# EasyEDA Pro project ProDoc_TP_V2.8_OP.epro

# Schematic Schematic_28_OP

## Sheets
1 MCU: Board Name: TP_V2.8; Create Date: 2024-10-01; Page Name: MCU; Project Name: gavvv; Schematic Name: Schematic_28; Update Date: 2024-10-01; Company: 嘉立创EDA; Page Size: A4; Version: V1.0
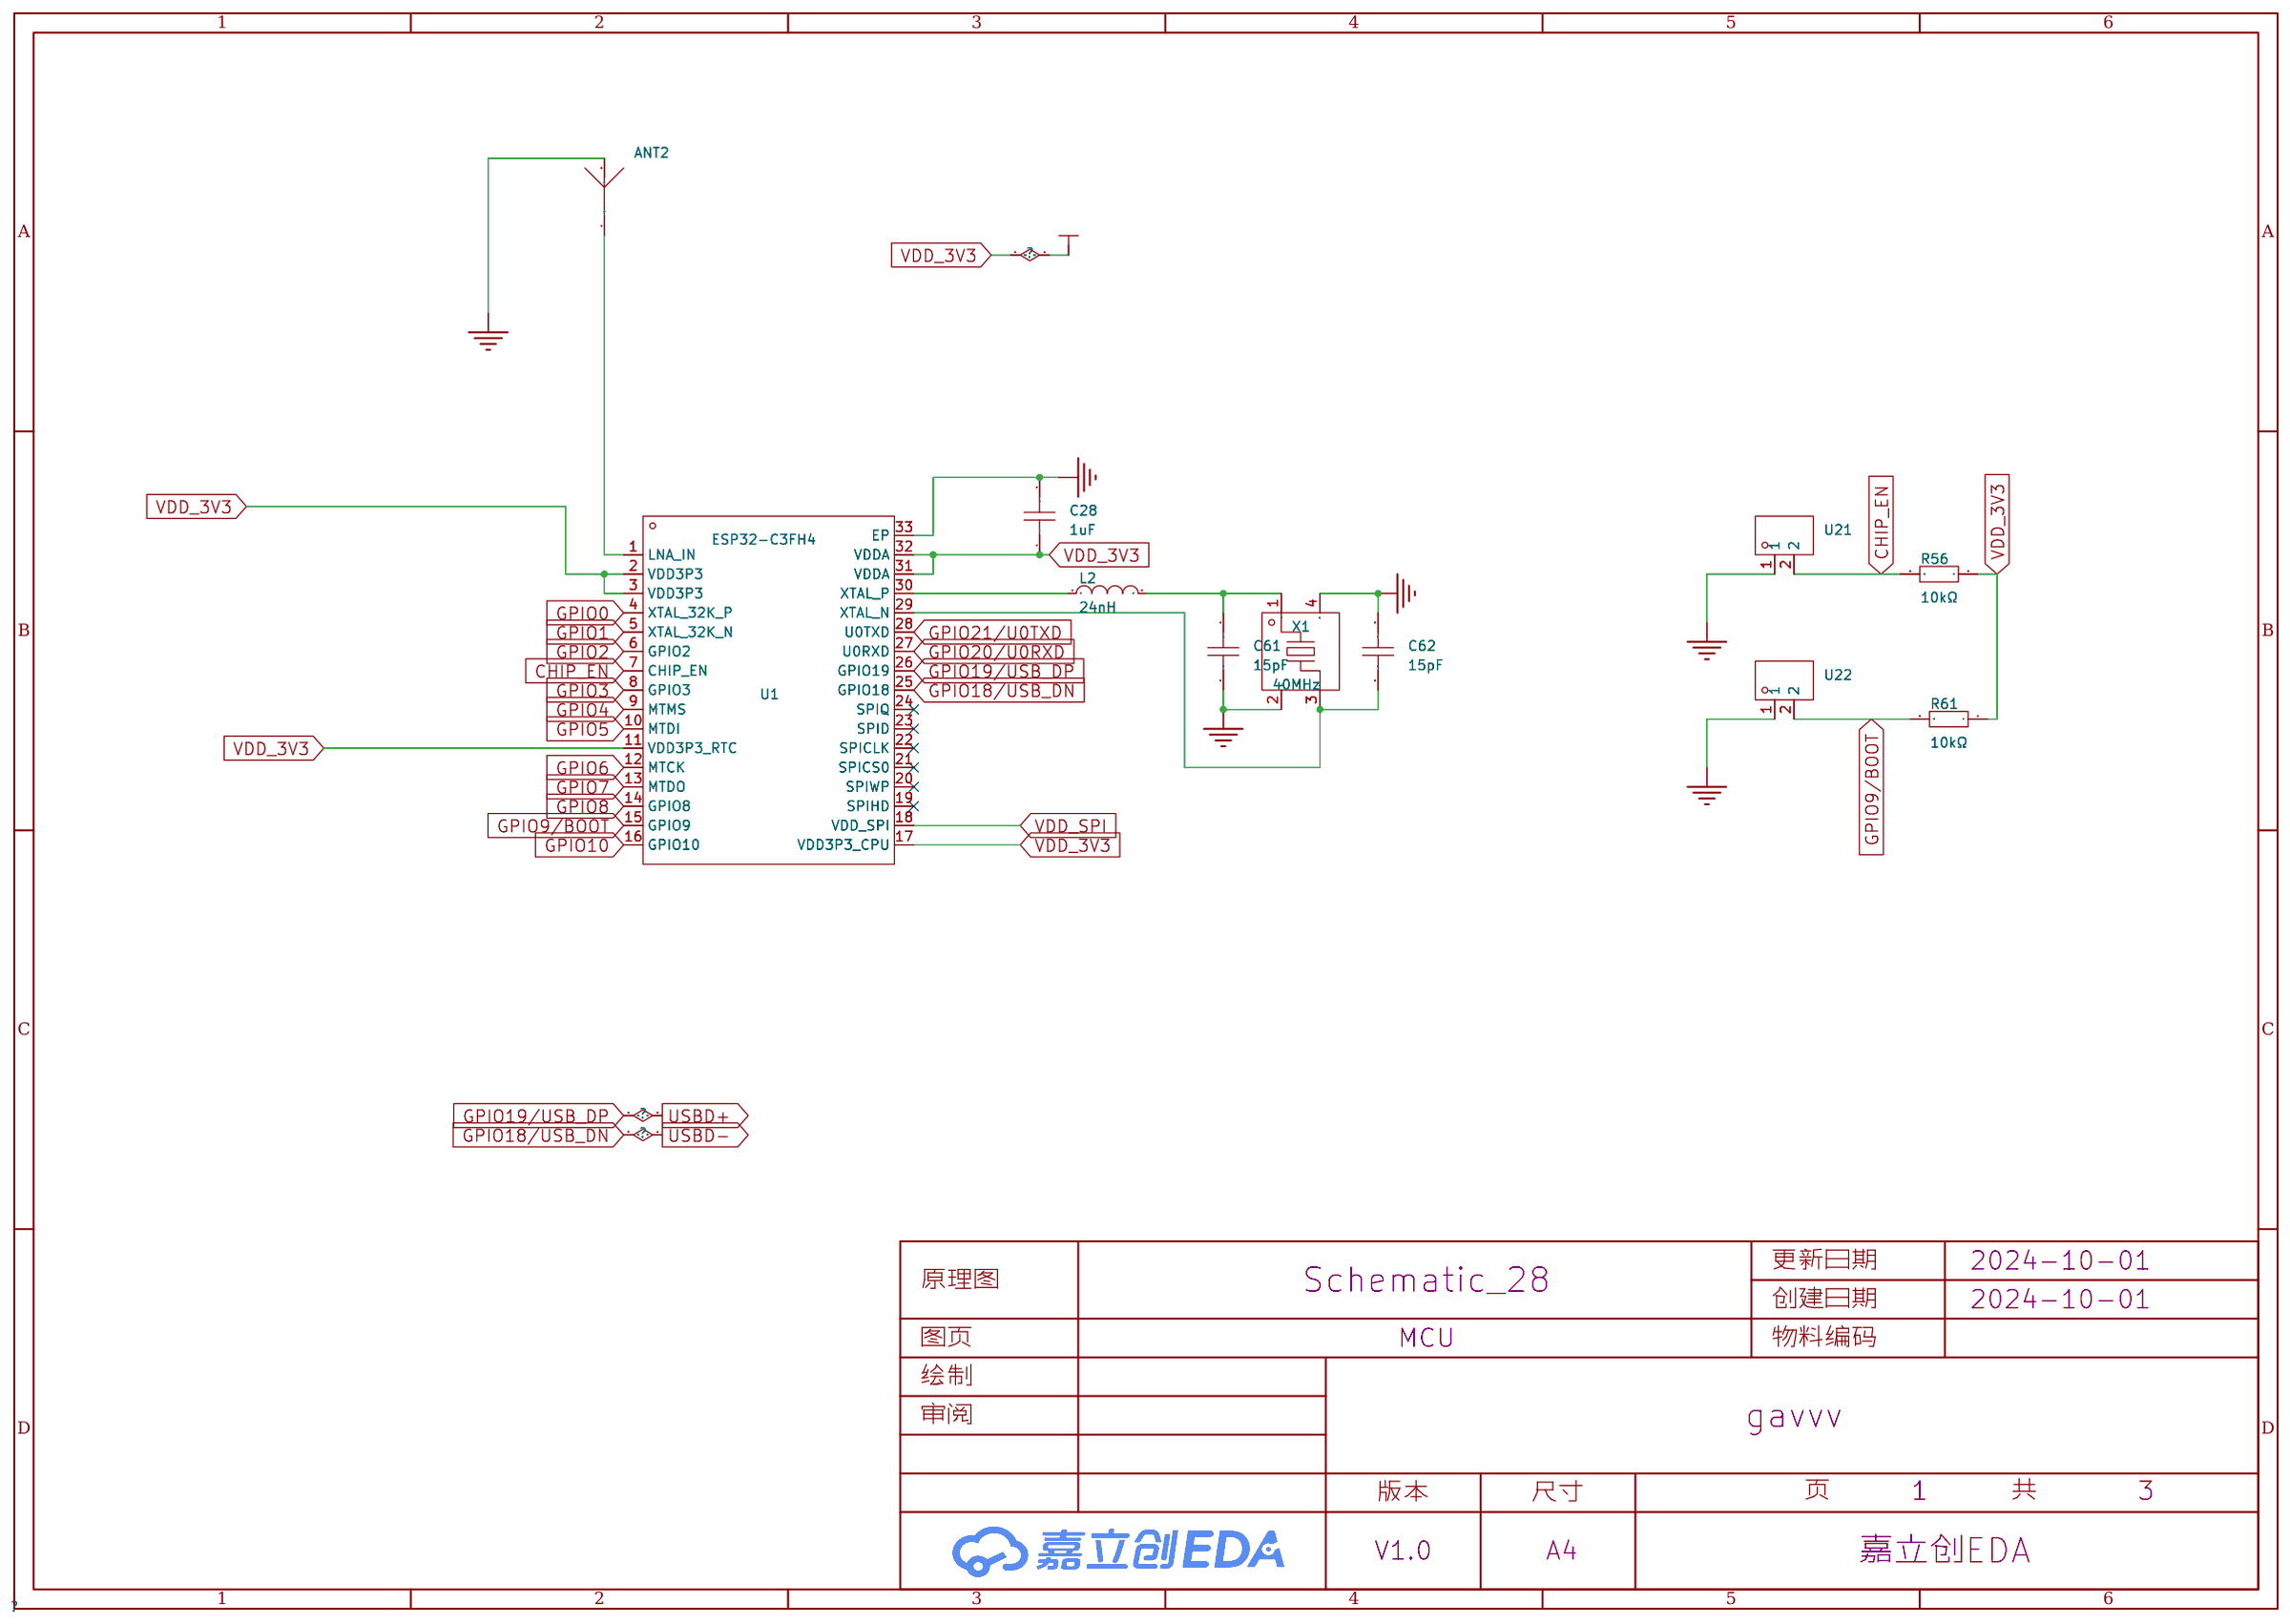
[diagram p0: MCU]
2 PWR: Page Name: PWR
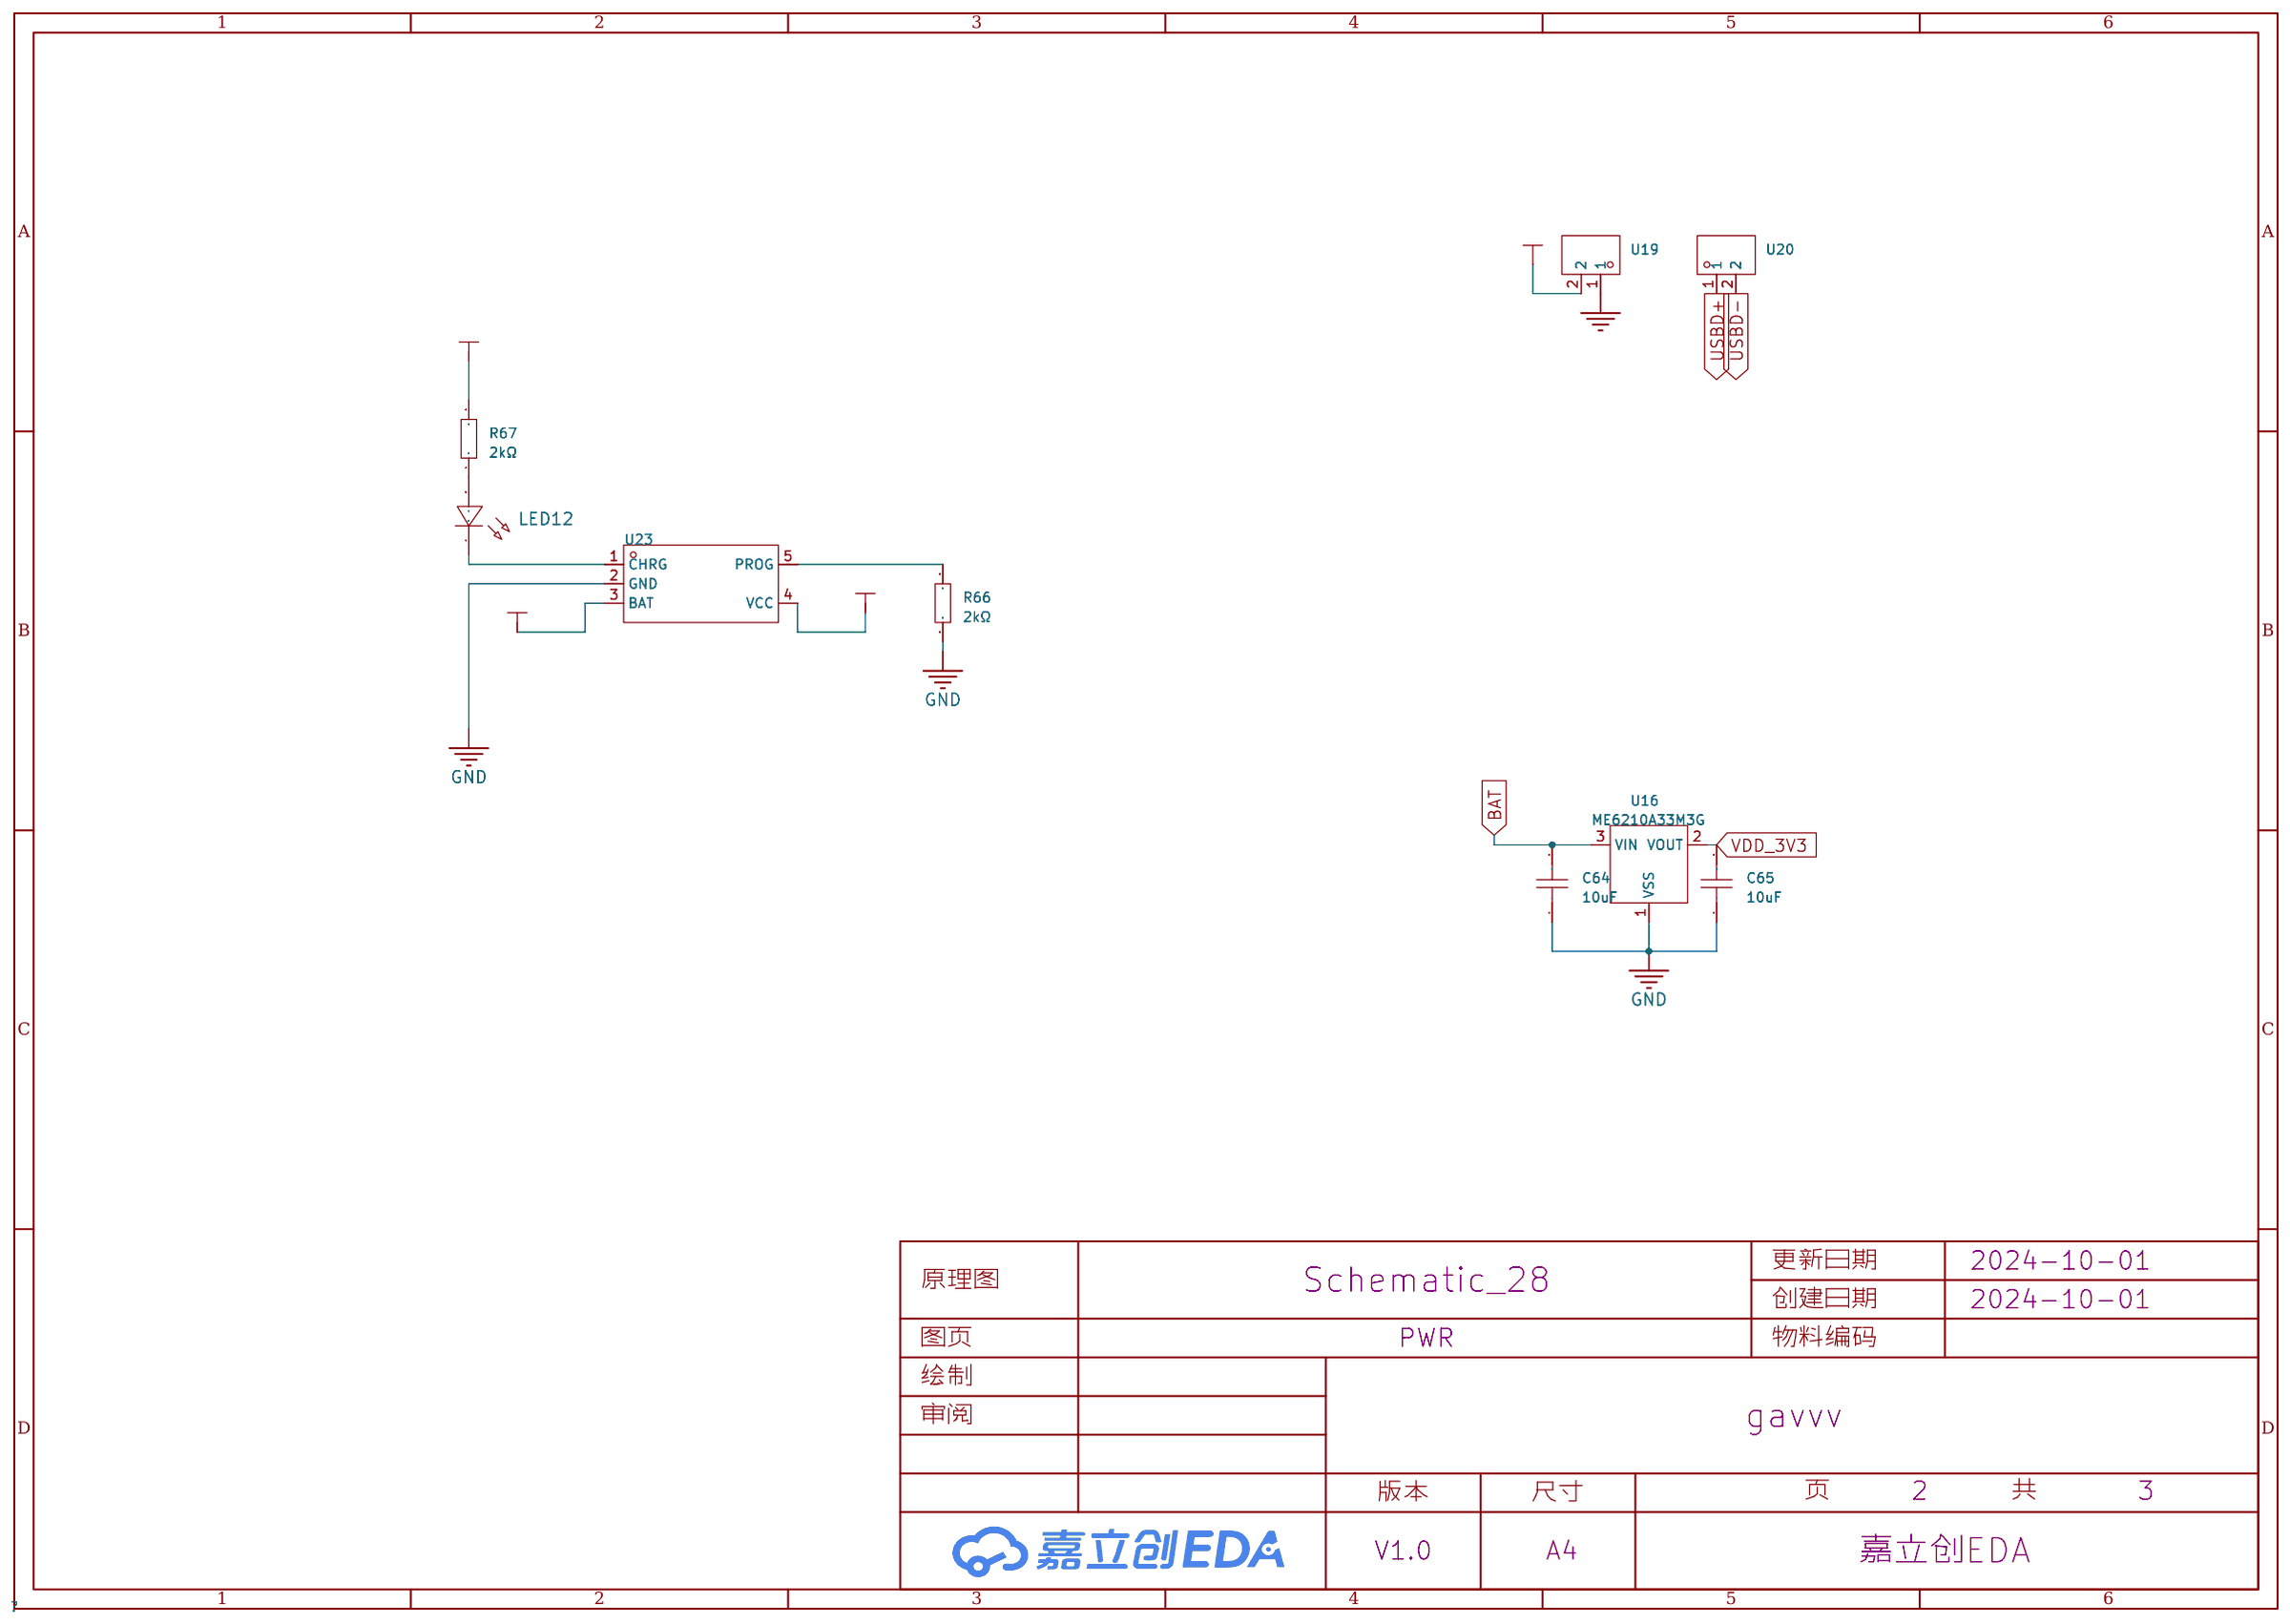
[diagram p1: PWR]
3 USER: Board Name: TP_V2.8_OP; Create Date: 2024-10-05; Page Name: USER; Schematic Name: Schematic_28_OP; Update Date: 2024-10-05
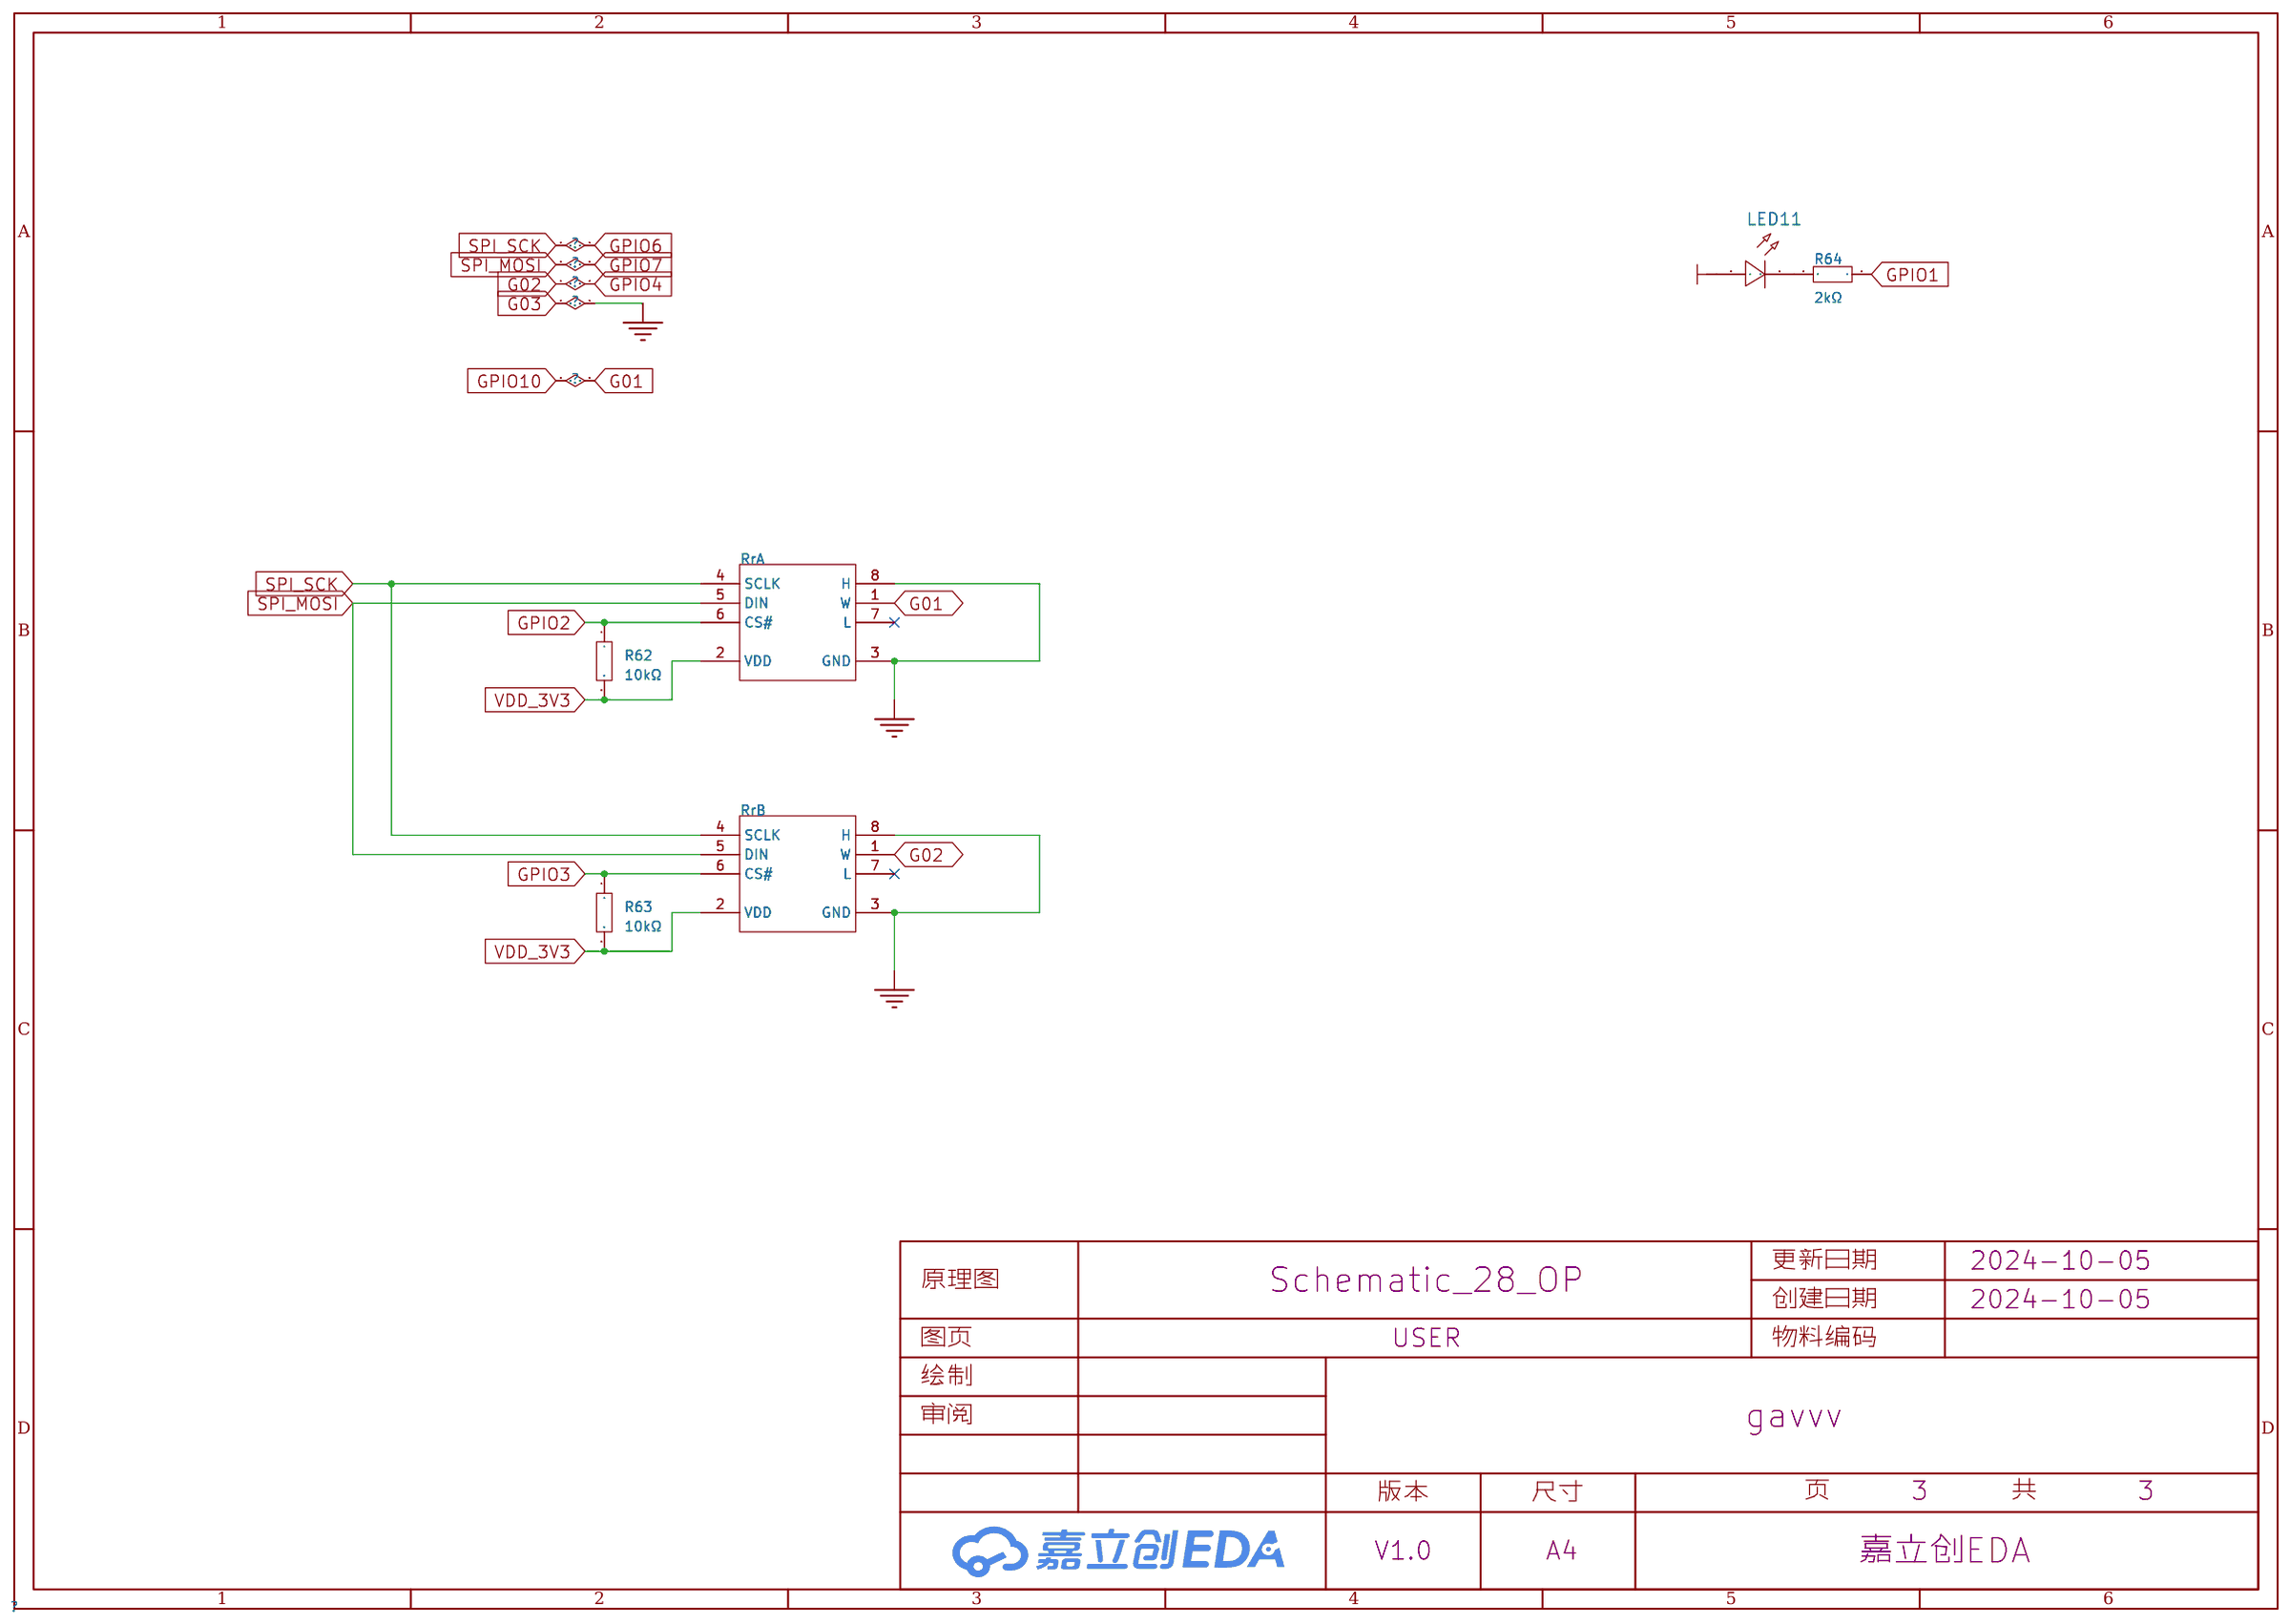
[diagram p2: USER]

## Parts
sheet MCU
ANT2  -  [ANT-SMD_L3.2-W1.6_CA-C01]
C28  1uF  [C0402]
C61  15pF  [C0402]
C62  15pF  [C0402]
L2  24nH  [IND-SMD_L1.0-W0.5-2]
R56  10kΩ  [R0402]
R61  10kΩ  [R0402]
U1  ESP32-C3FH4  [QFN-32_L5.0-W5.0-P0.50-TL-EP3.7]
U21  HX PZ1.0-1x2P ZZ  [HDR-TH_2P-P1.00-V-M]
U22  HX PZ1.0-1x2P ZZ  [HDR-TH_2P-P1.00-V-M]
X1  40MHz  [CRYSTAL-SMD_4P-L2.0-W1.6-BL_ECS_ECS-240-8-37]
sheet PWR
C64  10uF  [C0402]
C65  10uF  [C0402]
LED12  LED0402-红色  [LED0402-RD_RED]
R66  2kΩ  [R0402]
R67  2kΩ  [R0402]
U16  ME6210A33M3G  [SOT-23-3_L3.0-W1.7-P0.95-LS2.9-BR]
U19  X1311WV-02J-C40D24  [HDR-TH_2P-P1.27-V-M]
U20  X1311WV-02J-C40D24  [HDR-TH_2P-P1.27-V-M]
U23  TP4054  [SOT-23-5_L2.9-W1.6-P0.95-LS2.8-BR]
sheet USER
LED11  LED0402-红色  [LED0402-RD_RED]
R62  10kΩ  [R0402]
R63  10kΩ  [R0402]
R64  2kΩ  [R0402]
RrA  TPL0501-100DCNR  [SOT-23-8_L3.0-W1.7-P0.65-LS2.8-BL]
RrB  TPL0501-100DCNR  [SOT-23-8_L3.0-W1.7-P0.65-LS2.8-BL]

## Library data of the parts
ANT2 = CA-C01: Supplier Part: C9900018999; Supplier Footprint: SMD_3.2x1.6x0.4mm; JLCPCB Part Class: ExtendedPart; Datasheet: https://atta.szlcsc.comnull; Supplier: LCSC
C28 C61 C62 C64 C65 = CL05B104KB54PNC: 容值:100nF;精度:±10%;额定电压:50V;材质(温度系数):X7R;; LCSC Part Name: 100nF ±10% 50V; Supplier Part: C307331; Manufacturer: SAMSUNG(三星); Supplier Footprint: 0402; JLCPCB Part Class: 基础库; Datasheet: https://atta.szlcsc.com/upload/public/pdf/source/20181009/C307331_222F7C870FD3EA5F46F538B483443886.pdf; Supplier: LCSC; Tolerance: ±10%; Voltage Rated: 50V; Temperature Coefficient: X7R
L2 = LQW15AN24NG80D: 电感值:24nH;精度:±2%;额定电流:770mA;饱和电流(Isat):-;; LCSC Part Name: 24nH ±2%; Supplier Part: C668462; Manufacturer: muRata(村田); Supplier Footprint: 0402; JLCPCB Part Class: 扩展库; Datasheet: https://atta.szlcsc.com/upload/public/pdf/source/20201228/C668462_EF8FB8FB445A38E861DA03D3842BC057.pdf; Supplier: LCSC; Tolerance: ±2%; Rated Current: 770mA; DC Resistance (DCR): 212mΩ
R56 R61-R63 = 0402WGF1002TCE: 阻值:10kΩ;精度:±1%;功率:62.5mW;温度系数:±100ppm/℃;电阻类型:厚膜电阻;; LCSC Part Name: 10kΩ ±1% 62.5mW 厚膜电阻; Supplier Part: C25744; Manufacturer: UNI-ROYAL(厚声); Supplier Footprint: 0402; JLCPCB Part Class: Basic Part; Datasheet: https://atta.szlcsc.com/upload/public/pdf/source/20200306/C422600_1E6D84923E4A46A82E41ADD87F860B5C.pdf; Supplier: LCSC; Tolerance: ±1%; Power(Watts): 62.5mW; Overload Voltage (Max): 50V; Temperature Coefficient: ±100ppm/℃; Type: 厚膜电阻; Operating Temperature Range: -55℃~+155℃
U1 = ESP32-C3FH4: Supplier Part: C2858491; Manufacturer: ESPRESSIF(乐鑫); Supplier Footprint: QFN-32; JLCPCB Part Class: Extended Part; Datasheet: https://atta.szlcsc.com/upload/public/pdf/source/20210726/B8823F05EB5B1ECA99D4F01661A43FA8.pdf; Supplier: LCSC
U21 U22 = HX PZ1.0-1x2P ZZ: 插针结构:1x2P;间距:1mm;圆针/方针:方针;安装类型:直插;排数:单排;总PIN位数:2P;额定电流:750mA;配合针长度:2mm;塑高:1mm;端接针长度:2mm;触头材质:磷青铜;触头镀层:金;工作温度范围:-40℃~+105℃;焊接温度(最大值):260℃;颜色:黑色;; LCSC Part Name: 1x2P 间距:1mm 方针 直插; Supplier Part: C22438170; Manufacturer: hanxia(韩下); Supplier Footprint: 插件,P=1mm; JLCPCB Part Class: 扩展库; Datasheet: https://atta.szlcsc.com/upload/public/pdf/source/20240522/59E077311630E4900351916CE6BE2E74.pdf; Supplier: LCSC; Pin Structure: 1x2P; Pitch: 1mm; Circluar Pins/Square Pins: 方针; Mounting Type: 直插; Number of Rows: 单排; Number of Pins: 2P; Current Rating (Max): 750mA; Length of Mating Pin: 2mm; Insulation Height: 1mm; Length of End Connection Pin: 2mm; Contact Material: 磷青铜; Contact Plating: 金; Operating Temperature Range: -40℃~+105℃; Soldering Temperature(Max): 260℃; Color: 黑色
X1 = 7D040000I01: 频率:40MHz;频率公差:±10ppm;频率稳定度:±20ppm;负载电容:10pF;; LCSC Part Name: 40MHz ±10ppm 内置负载电容:10pF; Supplier Part: C648973; Manufacturer: HD(浩都频率); Supplier Footprint: SMD2016-4P; JLCPCB Part Class: 扩展库; Datasheet: https://atta.szlcsc.com/upload/public/pdf/source/20220223/118C2648083ADD7FA58C5549E27EC941.pdf; Supplier: LCSC; Crystal Type: 贴片无源晶振; Frequency Tolerance: ±10ppm; Frequency Stability: ±20ppm; Load Capacitance: 10pF
LED11 LED12 = LED0402-红色: Supplier Part: C9900023317; Supplier Footprint: LED_0402_RED; JLCPCB Part Class: ExtendedPart; Datasheet: https://atta.szlcsc.comnull; Supplier: LCSC
R64 R66 R67 = 0402WGF2001TCE: 电阻类型:厚膜电阻;阻值:2kΩ;精度:±1%;功率:62.5mW;; LCSC Part Name: 2kΩ±1%62.5mW; Supplier Part: C4109; Manufacturer: UNI-ROYAL(厚声); Supplier Footprint: 0402; JLCPCB Part Class: BasicPart; Datasheet: https://atta.szlcsc.com/upload/public/pdf/source/20200306/C422600_1E6D84923E4A46A82E41ADD87F860B5C.pdf; Supplier: LCSC; Type: 厚膜电阻; Tolerance: ±1%; Power(Watts): 62.5mW; Temperature Coefficient: ±100ppm/℃; Overload Voltage (Max): 50V; Operating Temperature Range: -55℃~+155℃
U16 = ME6210A33M3G: 输出类型:固定;输出极性:正;最大输入电压:18V;输出电压:3.3V;输出电流:500mA;电源纹波抑制比(PSRR):-;; LCSC Part Name: 正 Vin=18V Vout=3.3V 500mA; Supplier Part: C236680; Manufacturer: MICRONE(南京微盟); Supplier Footprint: SOT-23; JLCPCB Part Class: Extended Part; Datasheet: https://atta.szlcsc.com/upload/public/pdf/source/20180709/C236680_4A9EFC836B6D96276770F83E6DC5A093.pdf; Supplier: LCSC; Output Type: 固定; Output Polarity: 正; Number of Outputs: 1; Maximum Input Voltage: 18V; Output Voltage: 3.3V; Dropout Voltage: 260mV@(200mA); Output Current: 500mA
U19 U20 = X1311WV-02J-C40D24: 插针结构:1x2P;间距:1.27mm;行距:1.27mm;圆针/方针:方针;安装类型:-;排数:单排;总PIN位数:2P;额定电流:3A;额定电压:250V;配合针长度:-;塑高:1mm;端接针长度:-;触头材质:黄铜;触头镀层:金;工作温度范围:-40℃~+105℃;焊接温度(最大值):260℃;颜色:黑色;; LCSC Part Name: 1x2P 间距:1.27mm 方针; Supplier Part: C5243682; Manufacturer: XKB Connection(中国星坤); Supplier Footprint: 插件,P=1.27mm; JLCPCB Part Class: Extended Part; Datasheet: https://atta.szlcsc.com/upload/public/pdf/source/20221103/F707F495E439008E8A05CA9A3D33D9E0.pdf; Supplier: LCSC; Pin Structure: 1x2P; Pitch: 1.27mm; Row Spacing: 1.27mm; Circluar Pins/Square Pins: 方针; Number of Rows: 单排; Number of Pins: 2P; Current Rating (Max): 3A; Voltage Rating (Max): 250V; Insulation Height: 1mm; Contact Material: 黄铜; Contact Plating: 金; Operating Temperature Range: -40℃~+105℃; Soldering Temperature(Max): 260℃; Color: 黑色
U23 = TP4054_C5381776: 电源电压:4V~9V;最大充电电流:800mA;电池类型:锂离子/聚合物;电池节数:1;; Supplier Part: C5381776; Manufacturer: JSMSEMI(杰盛微); Supplier Footprint: SOT-23-5; JLCPCB Part Class: 扩展库; Datasheet: https://atta.szlcsc.com/upload/public/pdf/source/20240105/B23E77B3239CBD8CB006536E3C384378.pdf; Supplier: LCSC; The Chip Type: 电池管理; Supply Voltage: 4V~9V; Maximum Charge Current: 800mA; Type of Battery: 锂离子/聚合物; Number of Cells: 1; Operating Temperature: -40℃~+85℃
RrA RrB = TPL0501-100DCNR: 电阻值(欧姆):100kΩ;接口类型:SPI;供电电压:2.7V~5.5V;精度:±20%;; Supplier Part: C131323; Manufacturer: TI(德州仪器); Supplier Footprint: SOT-23-8; JLCPCB Part Class: 扩展库; Datasheet: https://www.ti.com/cn/lit/gpn/tpl0501-100; Supplier: LCSC; Resistance Value (Ohms): 100kΩ; Number of Taps: 256; Interface Type: SPI; Number of Channels: 1; Supply Voltage: 2.7V~5.5V; Precision: ±20%; Temperature Coefficient (Typ): 35ppm/℃; Operating Temperature: -40℃~+125℃

## Nets
3V3: C28.1 C65.2 LED11.2(A) R56.1 R61.1 R62.2 R63.2 RrA.2(VDD) RrB.2(VDD) U1.2(VDD3P3) U1.3(VDD3P3) U1.11(VDD3P3_RTC) U1.17(VDD3P3_CPU) U1.31(VDDA) U1.32(VDDA) U16.2(VOUT)
GND: ANT2.2 C28.2 C61.1 C62.2 C64.1 C65.1 R66.1 RrA.3(GND) RrA.8(H) RrB.3(GND) RrB.8(H) U1.33(EP) U16.1(VSS) U19.1 U21.1 U22.1 U23.2(GND) X1.2(GND) X1.4(GND)
VDD_SPI: U1.18(VDD_SPI)
VIN_5V: R67.2 U19.2 U23.4(VCC)
BAT: C64.2 U16.3(VIN) U23.3(BAT)
CHIP_EN: R56.2 U1.7(CHIP_EN) U21.2
G01: RrA.1(W) U1.16(GPIO10)
G02: RrB.1(W) U1.9(MTMS)
GPIO0: U1.4(XTAL_32K_P)
GPIO1: R64.1 U1.5(XTAL_32K_N)
GPIO2: R62.1 RrA.6(CS#) U1.6(GPIO2)
GPIO3: R63.1 RrB.6(CS#) U1.8(GPIO3)
GPIO5: U1.10(MTDI)
GPIO6: RrA.4(SCLK) RrB.4(SCLK) U1.12(MTCK)
GPIO7: RrA.5(DIN) RrB.5(DIN) U1.13(MTDO)
GPIO8: U1.14(GPIO8)
GPIO9/BOOT: R61.2 U1.15(GPIO9) U22.2
GPIO18/USB_DN: U1.25(GPIO18) U20.2
GPIO19/USB_DP: U1.26(GPIO19) U20.1
GPIO20/U0RXD: U1.27(U0RXD)
GPIO21/U0TXD: U1.28(U0TXD)
$1N988: C61.2 L2.2 X1.1
$1N989: L2.1 U1.30(XTAL_P)
$1N991: ANT2.1(ANT) U1.1(LNA_IN)
$1N995: C62.1 U1.29(XTAL_N) X1.3
$2N2933: R66.2 U23.5(PROG)
$2N3051: LED12.1(C) U23.1(CHRG)
$2N3155: LED12.2(A) R67.1
$3N2118: LED11.1(C) R64.2

Not connected (* = marked no-connect by the designer): RrA 7(L)*; RrB 7(L)*; U1 19(SPIHD)* 20(SPIWP)* 21(SPICS0)* 22(SPICLK)* 23(SPID)* 24(SPIQ)*

# Board Gochizo_V2.8_OP
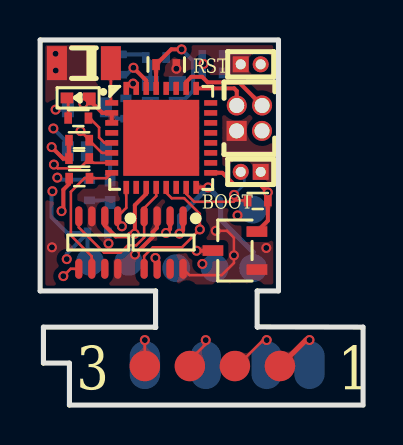
[diagram p3: board, top side]
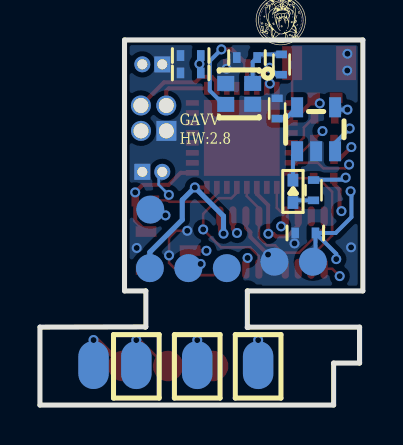
[diagram p4: board, bottom side, seen from below]

Outline 16.16 x 18.27 mm; copper layers: Top Layer, 内层1, 内层2, Bottom Layer. Coordinates in mm from the lower left corner of the outline.
Outline path: 5.79,3.88 5.74,3.93 5.71,3.9 0.16,3.9 0.16,2.1 1.46,2.1 1.46,0 16.16,0 16.16,3.9 10.87,3.91 10.89,3.89 ; 5.78,3.89 5.78,5.71 0,5.71 0,18.27 11.93,18.27 11.93,5.71 10.86,5.71 10.86,3.92
Stack: Top Layer 0.035mm 外层铜厚1oz / Dielectric1 0.2104mm 7628 RC49% 8.6mil / 内层1 0.0152mm 内层铜厚 / Dielectric2 1.065mm 1.1mm H/HOZ Copper / 内层2 0.0152mm 内层铜厚 / Dielectric3 0.2104mm 7628 RC49% 8.6mil / Bottom Layer 0.035mm 外层铜厚1oz

## Design rules (mm)
template: 自定义配置
spacing copperThickness1oz (default): track to track 0.102, other pairs 0 to 0.3
spacing copperThickness2oz: track to track 0.203, other pairs 0.152 to 0.3
track width copperThickness1oz (default): min 0.127, default 0.254, max 2.54
track width copperThickness2oz: min 0.203, default 0.254, max 2.54
differential pair differentialPair (default): width min 0.127, default 0.254, max 2.54; gap min 0.152, default 0.152
via viaSize (default): diameter min 0.5, default 0.61, max 10; hole min 0.3, default 0.305, max 6.3

## Placement (name value [footprint] x y rotation side)
ANT2  -  [ANT-SMD_L3.2-W1.6_CA-C01]  2.19 17.11 180 top
C28  1uF  [C0402]  8.62 16.62 0 bottom
C61  15pF  [C0402]  5.8 17.39 180 bottom
C62  15pF  [C0402]  6.31 17.04 0 top
C64  10uF  [C0402]  2.88 8.61 180 bottom
C65  10uF  [C0402]  8.62 17.49 180 bottom
L2  24nH  [IND-SMD_L1.0-W0.5-2]  4.07 17.04 90 bottom
LED11  LED0402-红色  [LED0402-RD_RED]  1.9 15.37 0 top
LED12  LED0402-红色  [LED0402-RD_RED]  3.5 10.69 270 bottom
NOREF  -  [Pad_e239]  9.75 1.95 180 top
NOREF#2  -  [Pad_e994]  6.81 6.85 180 top
NOREF#3  -  [Pad_e229]  5.24 1.95 180 top
NOREF#4  -  [Pad_e962]  8.74 6.85 180 top
NOREF#5  -  [Pad_e8]  13.48 2 180 top
NOREF#6  -  [Pad_e952]  10.66 6.85 180 top
NOREF#7  -  [Pad_e52]  10.64 9.78 180 top
NOREF#8  -  [Pad_e225]  8.29 2 180 top
NOREF#9  -  [Pad_e2874]  2.5 7.17 180 top
NOREF#10  -  [Pad_e228]  11.34 2 180 top
NOREF#11  -  [Pad_e222]  5.24 2 180 top
NOREF#12  -  [Pad_e237]  7.49 1.95 180 top
NOREF#13  -  [Pad_e2875]  4.43 7.17 180 top
NOREF#14  -  [Pad_e38]  12 1.95 180 top
R56  10kΩ  [R0402]  1.95 12.33 0 top
R61  10kΩ  [R0402]  10.89 10.21 180 top
R62  10kΩ  [R0402]  1.95 13.25 180 top
R63  10kΩ  [R0402]  1.96 11.35 180 top
R64  2kΩ  [R0402]  1.91 14.36 180 top
R66  2kΩ  [R0402]  4.29 14.84 270 bottom
R67  2kΩ  [R0402]  2.47 10.75 90 bottom
RrA  TPL0501-100DCNR  [SOT-23-8_L3.0-W1.7-P0.65-LS2.8-BL]  6.18 8.13 180 top
RrB  TPL0501-100DCNR  [SOT-23-8_L3.0-W1.7-P0.65-LS2.8-BL]  2.91 8.13 180 top
U1  ESP32-C3FH4  [QFN-32_L5.0-W5.0-P0.50-TL-EP3.7]  6.06 13.37 0 top
U16  ME6210A33M3G  [SOT-23-3_L3.0-W1.7-P0.95-LS2.9-BR]  9.75 7.73 0 top
U19  X1311WV-02J-C40D24  [HDR-TH_2P-P1.27-V-M]  10.47 13.72 0 top
U20  X1311WV-02J-C40D24  [HDR-TH_2P-P1.27-V-M#2]  10.47 14.99 180 top
U21  HX PZ1.0-1x2P ZZ  [HDR-TH_2P-P1.00-V-M]  10.54 17.05 0 top
U22  HX PZ1.0-1x2P ZZ  [HDR-TH_2P-P1.00-V-M]  10.54 11.67 180 top
U23  TP4054  [SOT-23-5_L2.9-W1.6-P0.95-LS2.8-BR]  2.34 13.8 270 bottom
X1  40MHz  [CRYSTAL-SMD_4P-L2.0-W1.6-BL_ECS_ECS-240-8-37]  6.19 15.57 0 bottom

## Footprints (pads in the part's own frame, mm; a bottom-side part is the same pattern mirrored in y, then rotated)
ANT-SMD_L3.2-W1.6_CA-C01
  rect 1x1.7 smd: 1(-1.35,0) 2(1.35,0)
C0402
  rect 0.381x0.54 smd: 1(-0.508,0) 2(0.508,0)
CRYSTAL-SMD_4P-L2.0-W1.6-BL_ECS_ECS-240-8-37
  rect 0.85x0.75 smd: 1(-0.675,-0.525) 2(0.675,-0.525) 3(0.675,0.525) 4(-0.675,0.525)
HDR-TH_2P-P1.00-V-M
  rect 0.8x0.8 hole 0.5: 1(-0.5,0)
  round 0.8 hole 0.5: 2(0.5,0)
HDR-TH_2P-P1.27-V-M
  rect 1x1 hole 0.75: 1(-0.635,0)
  round 1 hole 0.75: 2(0.635,0)
HDR-TH_2P-P1.27-V-M#2
  round 1 hole 0.75: 1(-0.635,0) 2(0.635,0)
IND-SMD_L1.0-W0.5-2
  rect 0.381x0.54 smd: 1(-0.508,0) 2(0.508,0)
LED0402-RD_RED
  rect 0.635x0.54 smd: 1(-0.559,0) 2(0.559,0)
Pad_e8
  oval 1.524x2.4 smd far side: 1(0,0)
Pad_e38
  round 1.524 smd: 1(0,0)
Pad_e52
  round 1.4 smd far side: 1(0,0)
Pad_e222
  oval 1.524x2.4 smd far side: 1(0,0)
Pad_e225
  oval 1.524x2.4 smd far side: 1(0,0)
Pad_e228
  oval 1.524x2.4 smd far side: 1(0,0)
Pad_e229
  round 1.524 smd: 1(0,0)
Pad_e237
  round 1.524 smd: 1(0,0)
Pad_e239
  round 1.524 smd: 1(0,0)
Pad_e952
  round 1.4 smd far side: 1(0,0)
Pad_e962
  round 1.4 smd far side: 1(0,0)
Pad_e994
  round 1.4 smd far side: 1(0,0)
Pad_e2874
  round 1.4 smd far side: 1(0,0)
Pad_e2875
  round 1.4 smd far side: 1(0,0)
QFN-32_L5.0-W5.0-P0.50-TL-EP3.7
  rect 0.65x0.28 smd: 1(-2.478,1.75) 2(-2.478,1.25) 3(-2.478,0.75) 4(-2.478,0.25) 5(-2.478,-0.25) 6(-2.478,-0.75) 7(-2.478,-1.25) 8(-2.478,-1.75) 17(2.478,-1.75) 18(2.478,-1.25) 19(2.478,-0.75) 20(2.478,-0.25) 21(2.478,0.25) 22(2.478,0.75) 23(2.478,1.25) 24(2.478,1.75)
  rect 0.28x0.65 smd: 9(-1.75,-2.478) 10(-1.25,-2.478) 11(-0.75,-2.478) 12(-0.25,-2.478) 13(0.25,-2.478) 14(0.75,-2.478) 15(1.25,-2.478) 16(1.75,-2.478) 25(1.75,2.478) 26(1.25,2.478) 27(0.75,2.478) 28(0.25,2.478) 29(-0.25,2.478) 30(-0.75,2.478) 31(-1.25,2.478) 32(-1.75,2.478)
  rect 3.8x3.8 smd: 33(0,0)
R0402
  rect 0.381x0.54 smd: 1(-0.508,0) 2(0.508,0)
SOT-23-3_L3.0-W1.7-P0.95-LS2.9-BR
  rect 1.038x0.532 smd: 1(1.101,-0.95) 2(1.101,0.95) 3(-1.101,0)
SOT-23-5_L2.9-W1.6-P0.95-LS2.8-BR
  rect 1x0.6 smd: 1(1.1,-0.95) 2(1.1,0) 3(1.1,0.95) 4(-1.1,0.95) 5(-1.1,-0.95)
SOT-23-8_L3.0-W1.7-P0.65-LS2.8-BL
  oval 0.364x1 smd: 1(-0.975,-1.312) 2(-0.325,-1.312) 3(0.325,-1.312) 4(0.975,-1.312) 5(0.975,1.312) 6(0.325,1.312) 7(-0.325,1.312) 8(-0.975,1.312)

## Nets
3V3: C28.1 C65.2 LED11.2 R56.1 R61.1 R62.2 R63.2 RrA.2 RrB.2 U1.2 U1.3 U1.11 U1.17 U1.31 U1.32 U16.2
5V_1: NOREF#5.1 NOREF#14.1
GND: ANT2.2 C28.2 C61.1 C62.2 C64.1 C65.1 NOREF#13.1 R66.1 RrA.3 RrA.8 RrB.3 RrB.8 U1.33 U16.1 U19.1 U21.1 U22.1 U23.2 X1.2 X1.4
VDD_SPI: U1.18
VIN_5V: NOREF#7.1 R67.2 U19.2 U23.4
BAT: C64.2 NOREF#9.1 U16.3 U23.3
CHIP_EN: R56.2 U1.7 U21.2
G01: NOREF#6.1 RrA.1 U1.16
G01-1: NOREF.1 NOREF#10.1
G02: NOREF#4.1 RrB.1 U1.9
G02-1: NOREF#8.1 NOREF#12.1
G03: NOREF#2.1
G03-1: NOREF#3.1 NOREF#11.1
GPIO0: U1.4
GPIO1: R64.1 U1.5
GPIO2: R62.1 RrA.6 U1.6
GPIO3: R63.1 RrB.6 U1.8
GPIO5: U1.10
GPIO6: RrA.4 RrB.4 U1.12
GPIO7: RrA.5 RrB.5 U1.13
GPIO8: U1.14
GPIO9/BOOT: R61.2 U1.15 U22.2
GPIO18/USB_DN: U1.25 U20.2
GPIO19/USB_DP: U1.26 U20.1
GPIO20/U0RXD: U1.27
GPIO21/U0TXD: U1.28
$1N988: C61.2 L2.2 X1.1
$1N989: L2.1 U1.30
$1N991: ANT2.1 U1.1
$1N995: C62.1 U1.29 X1.3
$2N2933: R66.2 U23.5
$2N3051: LED12.1 U23.1
$2N3155: LED12.2 R67.1
$3N2118: LED11.1 R64.2

Pads without a net: RrA 7; RrB 7; U1 19 20 21 22 23 24

## Via types
v1: diameter 0.5, hole 0.3, Top Layer to Bottom Layer, 40 vias

## Routing (per net, layer and track width the routed paths; a pad name or vN(x,y) marks a point on that pad's centre or on a via; arc(x,y) is an arc through that point)
3V3: length 47.6
  Top Layer w0.127: U1.32 4.55,16.09 v1(4.65,16.09)
  Top Layer w0.2: R63.2 1.45,11.07 1.16,10.78 1.16,9.8 v1(1.07,9.7) ; U1.17 9.12,11.62 9.72,11.02 11.02,11.02 v1(11.4,10.64) 11.4,10.64 R61.1 11.4,9.23 U16.2 ; v1(2.16,15.1) 2.63,15.1 3.11,14.62 U1.2 U1.3 ; U1.11 5.31,10.57 4.74,10 4.74,8.58 v1(4.73,8.57) 4.48,8.57 4.35,8.44 3.78,8.44 3.24,8.98 3.24,9.44 ; v1(0.57,12.91) 1.15,12.33 R56.1 R62.2 ; v1(6.3,8.61) 6.5,8.82 RrA.2
  内层1 w0.2: v1(11.4,10.64) 10.81,10.64 10.16,9.99 7.42,9.99 6.53,9.1 6.53,8.84 v1(6.3,8.61) ; v1(0.57,12.91) 1.23,12.91 1.52,13.2 1.52,13.92 2.16,14.56 v1(2.16,15.1) 4.02,15.1 4.3,15.37 ; v1(8.18,17.07) 6.48,15.37 4.3,15.37 ; 4.3,15.37 4.65,15.73 v1(4.65,16.09) ; v1(1.07,9.7) 1.07,9.52 1.17,9.42 2.9,9.42 3.88,8.44 4.3,8.44 4.43,8.57 v1(4.73,8.57)
  内层2 w0.2: v1(4.73,8.57) 6.26,8.57 v1(6.3,8.61) ; v1(2.16,15.1) 2.16,14.4 2.62,13.94 2.62,11.67 1.07,10.12 v1(1.07,9.7)
  Bottom Layer w0.2: C65.2 C28.1
5V_1: length 2
  Top Layer w0.254: v1(13.48,3.25) 13.3,3.25 NOREF#14.1
GND: length 7.6
  Top Layer w0.127: v1(8.79,8.72) 9.35,8.72 9.7,8.37 v1(9.7,7.49) 9.7,7.11 9.09,6.5 7.47,6.5 RrA.8
  Top Layer w0.2: v1(4.75,7.53) 5.63,8.42 5.63,8.65 5.84,8.86 5.84,9.13 5.85,9.15 RrA.3
  vias: v1(0.59,7.89) v1(0.77,17.58) v1(0.78,16.74) v1(3.42,8.09) v1(6.82,16.83) v1(11.32,7.86)
VIN_5V: length 30.3
  内层1 w0.2: U19.2 11.1,13.2 10.86,12.96 8.68,12.96 7.1,11.38 v1(0.86,11.38)
  内层2 w0.2: 8.78,12.97 8.55,12.97 6.26,15.26 3.49,15.26 3.15,15.6 1.4,15.6 0.77,14.97 v1(0.77,14.78) ; 8.78,12.97 9.23,12.97 9.23,12.97 10.44,12.97 10.44,12.97 10.88,12.97 11.1,13.2 U19.2 ; 8.78,12.97 9.04,12.72 9.04,10.33 v1(9.88,9.49)
  Bottom Layer w0.2: v1(0.86,11.38) 0.96,11.28 2.45,11.28 R67.2 ; v1(0.77,14.78) 1.27,14.78 U23.4
BAT: length 20.1
  Top Layer w0.2: v1(7.83,7.72) 8.64,7.72 U16.3
  内层1 w0.2: v1(1.33,7.3) 1.67,7.3 2.37,6.6 6.71,6.6 v1(7.83,7.72)
  内层2 w0.2: v1(0.66,13.84) 0.66,13.53 1.36,12.83 1.36,11.17 0.88,10.69 0.62,10.69 v1(0.61,10.7)
  Bottom Layer w0.2: NOREF#9.1 2.37,7.3 C64.2 ; v1(1.33,7.3) 1.33,7.57 C64.2 ; U23.3 1.39,13.11 v1(0.66,13.84) ; C64.2 1.36,8.61 0.57,9.4 0.57,10.66 v1(0.61,10.7)
CHIP_EN: length 15.9
  Top Layer w0.127: v1(0.69,12.04) 0.88,11.85 1.97,11.85 R56.2 2.67,12.12 U1.7
  内层1 w0.2: 11.04,17.08 11.04,16.72 10.65,16.33 9.29,16.33 7.94,14.98 4.42,14.98 1.47,12.04 v1(0.69,12.04)
G01: length 9.4
  Top Layer w0.2: U1.16 7.81,10.89 v1(8.41,10.89) ; v1(6.97,8.58) 7.16,8.76 RrA.1
  Bottom Layer w0.254: NOREF#6.1 10.66,7.65 9.04,9.27 9.04,10.26 v1(8.41,10.89) 6.97,9.46 v1(6.97,8.58)
G01-1: length 2
  Top Layer w0.127: 9.86,1.95 11.16,3.25 v1(11.34,3.25)
G02: length 8.6
  Top Layer w0.127: U1.9 4.31,9.87 RrB.1
  Top Layer w0.2: v1(4.09,8.94) 3.88,9.15 RrB.1
  内层1 w0.2: v1(8.12,7.06) 8.12,7.1 8.62,7.6 8.62,7.8 8.14,8.28 7.39,8.28 7.18,8.08 6.08,8.08 4.85,9.3 4.45,9.3 v1(4.09,8.94)
G02-1: length 1.8
  Top Layer w0.127: 7.19,1.95 8.29,3.05 v1(8.29,3.25)
G03-1: length 1.3
  Top Layer w0.127: v1(5.24,3.25) NOREF#3.1
GPIO1: length 1.9
  Top Layer w0.127: U1.5 3.22,13.12 2.95,13.39 2.95,13.89 2.56,14.28 2.42,14.28
GPIO2: length 14.4
  Top Layer w0.127: U1.6 3.09,12.62 R62.1 2.46,13.27 v1(2.02,13.71) ; v1(5.77,7.36) 5.85,7.28 RrA.6
  内层2 w0.127: v1(5.77,7.36) 5.23,6.82 2.47,6.82 0.61,8.69 0.61,10.03 2.02,11.45 v1(2.02,13.71)
GPIO3: length 6.7
  Top Layer w0.127: U1.8 3.31,11.35 R63.1 2.22,11.35 1.54,10.67 1.54,8.48 2.59,7.44 RrB.6
GPIO6: length 7.4
  Top Layer w0.127: RrB.4 1.94,8.89 3.2,7.62 4.02,7.62 4.39,8 4.81,8 5.21,8.39 RrA.4 5.21,9.86 5.81,10.46 U1.12
GPIO7: length 16
  Top Layer w0.127: RrB.5 1.53,6.82 v1(1.16,6.45) ; RrA.5 5.21,7.46 5.64,7.9 7.1,7.9 v1(7.99,8.79) 7.99,9.57 7.21,10.35 6.58,10.35 6.31,10.62 U1.13
  内层2 w0.127: v1(7.99,8.79) 7.99,8.71 6.91,7.63 6.91,7.45 5.91,6.45 v1(1.16,6.45)
GPIO9/BOOT: length 5.3
  Top Layer w0.127: U1.15 7.31,10.57 7.71,10.17 9.69,10.17 9.76,10.24 ; R61.2 10.35,10.24 9.76,10.24 ; 9.76,10.24 9.76,10.47 v1(9.71,10.52)
  Bottom Layer w0.127: v1(9.71,10.52) 10.22,11.03 10.22,11.49 U22.2
GPIO18/USB_DN: length 2.8
  Top Layer w0.2: U20.2 9.84,15.72 9.71,15.85 U1.25
GPIO19/USB_DP: length 4.8
  Top Layer w0.2: U20.1 9.95,16.15 8.38,16.15 8.11,16.43 7.57,16.43 7.31,16.17 U1.26
$1N988: length 2.7
  Bottom Layer w0.2: 5.52,16.1 5.52,17.17 C61.2 5.13,17.55 L2.2
$1N989: length 2
  Top Layer w0.2: U1.30 5.31,16.24 v1(4.67,16.88)
  Bottom Layer w0.2: v1(4.67,16.88) 4.32,16.53 L2.1
$1N991: length 2
  Top Layer w0.127: ANT2.1 3.54,15.16 U1.1
$1N995: length 6.2
  Top Layer w0.2: v1(7.08,17.8) 6.56,17.8 C62.1 5.8,15.86 U1.29
  Bottom Layer w0.2: v1(7.08,17.8) 7.66,17.22 7.66,15.74 6.97,15.05 X1.3
$2N2933: length 1.2
  Bottom Layer w0.2: U23.5 3.86,14.33 R66.2
$2N3051: length 1.5
  Bottom Layer w0.2: LED12.1 3.5,12.49 U23.1
$2N3155: length 1.1
  Bottom Layer w0.2: LED12.2 3.39,10.24 R67.1
$3N2118: length 1.1
  Top Layer w0.127: LED11.1 1.4,15.31 1.4,14.28

## Copper pours and planes (outline as drawn; the poured copper is in the pictures)
GND on Top Layer: -1.91,20.75 21.42,20.75 21.42,3.53 -1.91,3.53
GND on Bottom Layer: -7.98,20.41 15.47,20.41 15.47,4.62 -7.98,4.62
GND on 内层1: -2.29,19.66 20.08,19.66 20.08,4.41 -2.29,4.41
GND on 内层2: -4.21,19.03 17.57,19.03 17.57,3.53 -4.21,3.53

Small or netless copper shapes (teardrops, artwork), in the pictures only: 62 on Top Layer, 32 on Bottom Layer, 15 on 内层1, 12 on 内层2

## Text on the board
Bottom Silkscreen Layer: GAVV / HW:2.8
Top Silkscreen Layer: RST | BOOT | 3 | 1
